# EAGLE design Power+LCD (EAGLE 7.5.0)
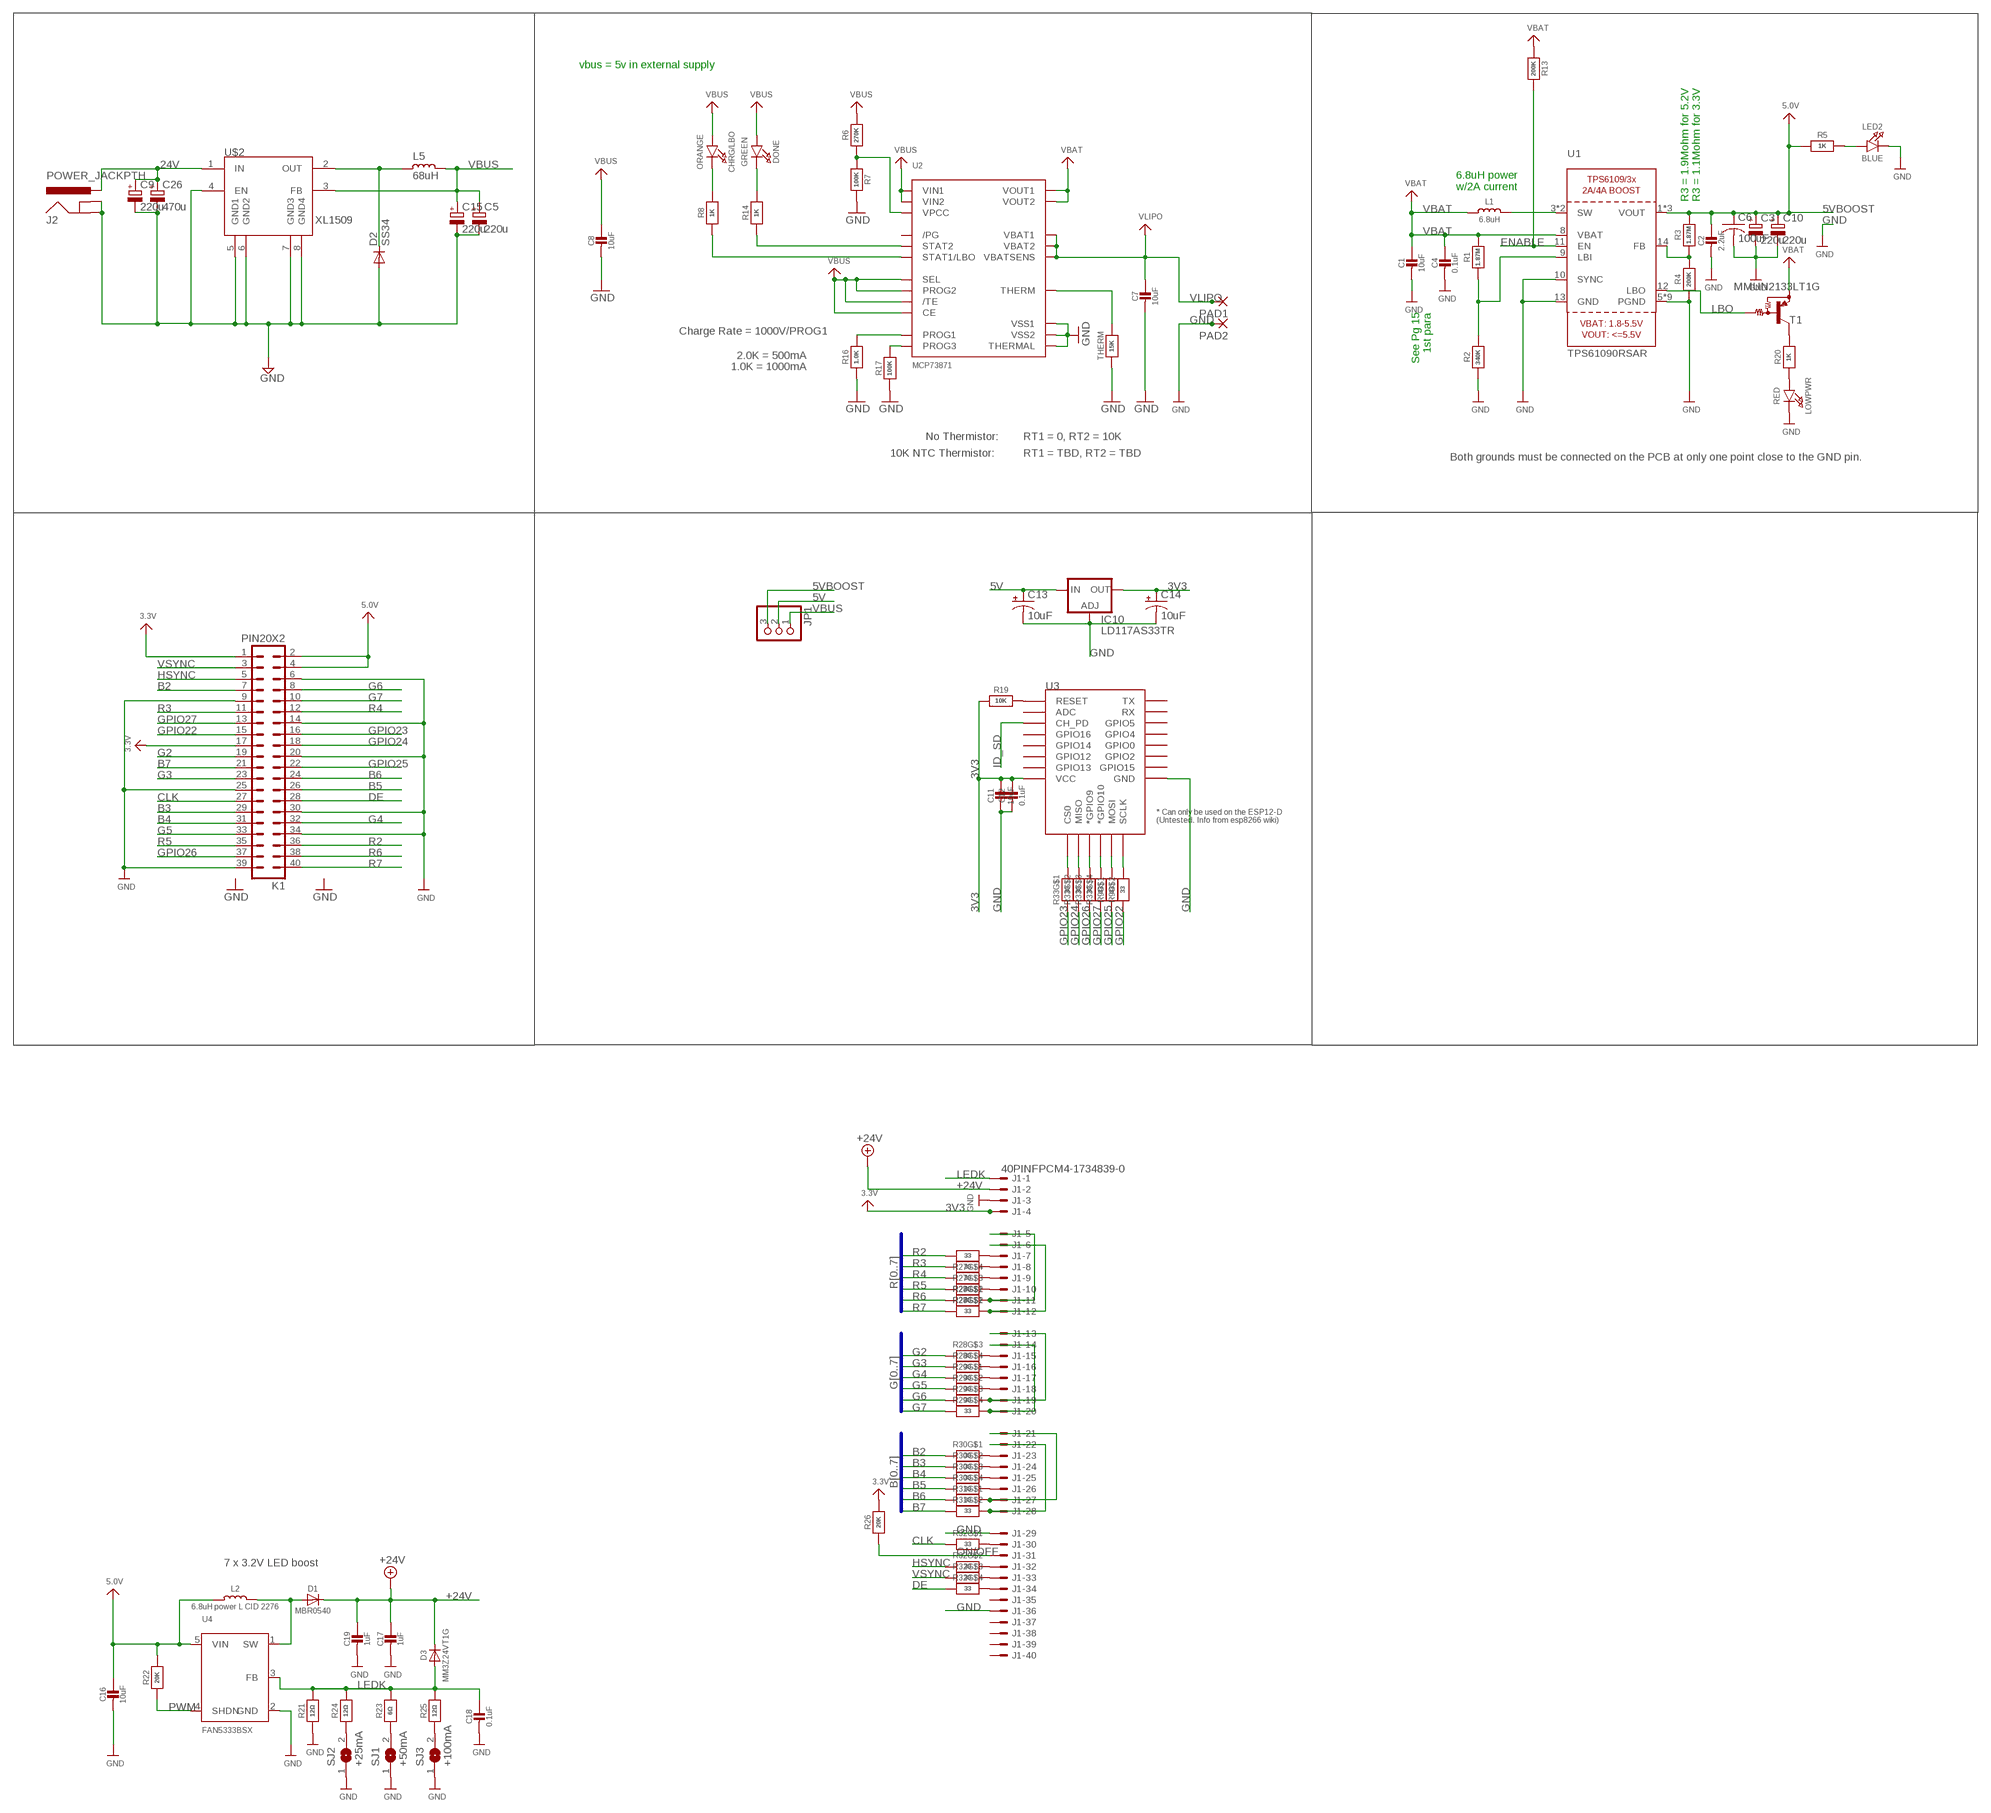
[diagram p0: schematic, sheet 1]

## Parts
C1  10uF  CAP_CERAMIC_1206MP  [_1206MP]
C2  2.2uF  CAP_CERAMIC0805-NOOUTLINE  [0805-NO]
C3  220u  CPOL-EUE2.5-7  [E2,5-7]
C4  0.1uF  CAP_CERAMIC0805_10MGAP  [0805_10MGAP]
C5  220u  CPOL-EUD  [PANASONIC_D]
C6  100uF  C-USC1210  [C1210]
C7  10uF  CAP_CERAMIC_1206MP  [_1206MP]
C8  10uF  CAP_CERAMIC_1206MP  [_1206MP]
C9  220u  CPOL-EUD  [PANASONIC_D]
C10  220u  CPOL-EUD  [PANASONIC_D]
C11  10uF  CAP_CERAMIC_1206MP  [_1206MP]
C12  0.1uF  CAP_CERAMIC0805_10MGAP  [0805_10MGAP]
C13  10uF  CAP_POL1206  [EIA3216]
C14  10uF  CAP_POL1206  [EIA3216]
C15  220u  CPOL-EUE2.5-7  [E2,5-7]
C16  10uF  CAP_CERAMIC_1206MP  [_1206MP]
C17  1uF  CAP_CERAMIC_0805MP  [_0805MP]
C18  0.1uF  CAP_CERAMIC0805-NOOUTLINE  [0805-NO]
C19  1uF  CAP_CERAMIC_0805MP  [_0805MP]
C26  470u  CPOL-EUE2.5-7  [E2,5-7]
CHRG/LBO  ORANGE  LED0805_NOOUTLINE  [CHIPLED_0805_NOOUTLINE]
D1  MBR0540  DIODESOD-123  [SOD-123]
D2  SS34  DIODE-DO-214AC  [DO-214AC]
D3  MM3Z24VT1G  DIODESMA  [SMADIODE]
DONE  GREEN  LED0805_NOOUTLINE  [CHIPLED_0805_NOOUTLINE]
IC10  LD117AS33TR  [SOT223]
J1  40PINFPCM4-1734839-0  [4-1734839-0]
J2  POWER_JACKPTH  [POWER_JACK_PTH]
JP1  PINHD-1X3  [1X03]
K1  PIN20X2  [PIN_20X2]
L1  6.8uH  INDUCTORTDK_VLC5045  [INDUCTOR_5X5MM_TDK_VLC5045]
L2  6.8uH power L CID 2276  INDUCTORNR5040  [INDUCTOR_5X5MM_NR5040_NOTHERMALS]
L5  68uH  L_CD75  [CD75]
LED2  BLUE  LED0805_NOOUTLINE  [CHIPLED_0805_NOOUTLINE]
LOWPWR  RED  LED0805_NOOUTLINE  [CHIPLED_0805_NOOUTLINE]
PAD1  3,81/1,4  [3,81/1,4]
PAD2  3,81/1,4  [3,81/1,4]
R1  1.87M  RESISTOR_0805MP  [_0805MP]
R2  340K  RESISTOR_0805MP  [_0805MP]
R3  1.87M  RESISTOR0805_NOOUTLINE  [0805-NO]
R4  200K  RESISTOR0805_NOOUTLINE  [0805-NO]
R5  1K  RESISTOR0805_NOOUTLINE  [0805-NO]
R6  270K  RESISTOR0805_NOOUTLINE  [0805-NO]
R7  100K  RESISTOR0805_NOOUTLINE  [0805-NO]
R8  1K  RESISTOR0805_NOOUTLINE  [0805-NO]
R9  33  RESISTOR_4PACK  [RESPACK_4X0603]
R13  200K  RESISTOR0805_NOOUTLINE  [0805-NO]
R14  1K  RESISTOR0805_NOOUTLINE  [0805-NO]
R16  1.0K  RESISTOR0805_NOOUTLINE  [0805-NO]
R17  100K  RESISTOR0805_NOOUTLINE  [0805-NO]
R19  10K  RESISTOR0805_NOOUTLINE  [0805-NO]
R20  1K  RESISTOR0805_NOOUTLINE  [0805-NO]
R21  12Ω  RESISTOR0805_NOOUTLINE  [0805-NO]
R22  20K  RESISTOR0805_NOOUTLINE  [0805-NO]
R23  6Ω  RESISTOR0805_NOOUTLINE  [0805-NO]
R24  12Ω  RESISTOR0805_NOOUTLINE  [0805-NO]
R25  12Ω  RESISTOR0805_NOOUTLINE  [0805-NO]
R26  20K  RESISTOR_0805MP  [_0805MP]
R27  33  RESISTOR_4PACK  [RESPACK_4X0603]
R28  33  RESISTOR_4PACK  [RESPACK_4X0603]
R29  33  RESISTOR_4PACK  [RESPACK_4X0603]
R30  33  RESISTOR_4PACK  [RESPACK_4X0603]
R31  33  RESISTOR_4PACK  [RESPACK_4X0603]
R32  33  RESISTOR_4PACK  [RESPACK_4X0603]
R33  33  RESISTOR_4PACK  [RESPACK_4X0603]
SJ1  +50mA  SOLDERJUMPER  [SOLDERJUMPER_ARROW_NOPASTE]
SJ2  +25mA  SOLDERJUMPER  [SOLDERJUMPER_ARROW_NOPASTE]
SJ3  +100mA  SOLDERJUMPER  [SOLDERJUMPER_ARROW_NOPASTE]
T1  MMUN2133LT1G  MUN2114T1-PNP_DRIVER-SC59-BEC  [SC59-BEC]
THERM  15K  RESISTOR0805_NOOUTLINE  [0805-NO]
U1  TPS61090RSAR  VREG_TPS6103X  [PVQFN-16]
U2  MCP73871  [QFN20_4MM]
U3  ESP12ESMD  [ESP12E-SMD]
U4  FAN5333BSX  FAN5331  [SOT23-5@1]
U$2  XL1509  [SO08]

## Nets
3V3: C11.1 C12.1 C14.A(+) IC10.4(OUT) J1.4 K1.1 K1.17 R19.1 R26.2 U3.VCC ; supply symbol labelled 3.3V
5V: C13.A(+) C16.1 IC10.3(IN) JP1.2 K1.2 K1.4 L2.P$1 R22.2 U4.5(VIN) ; supply symbol labelled 5.0V
5VBOOST: C2.1 C3.+ C6.1 C10.+ JP1.3 R3.2 R5.1 U1.1(VOUT) U1.15(VOUT) U1.16(VOUT) ; supply symbol labelled 5.0V
24V: C9.+ C26.+ J2.PWR U$2.1(IN)
+24V: C17.1 C19.1 D1.C D3.C J1.2
B2: K1.7 R30.1
B3: K1.29 R30.2
B4: K1.31 R30.3
B5: K1.26 R30.4
B6: K1.24 R31.1
B7: K1.21 R31.2
CLK: K1.27 R32.1
DE: K1.28 R32.4
ENABLE: R13.2 U1.11(EN)
G2: K1.19 R28.3
G3: K1.23 R28.4
G4: K1.32 R29.1
G5: K1.33 R29.2
G6: K1.8 R29.3
G7: K1.10 R29.4
GND: C1.2 C2.2 C3.- C4.2 C5.- C6.2 C7.2 C8.2 C9.- C10.- C11.2 C12.2 C13.C(-) C14.C(-) C15.- C16.2 C17.2 C18.2 C19.2 C26.- D2.2(A) IC10.1(ADJ) J1.3 J1.29 J1.36 J2.GND J2.GNDBREAK K1.6 K1.9 K1.14 K1.20 K1.25 K1.30 K1.34 K1.39 LED2.C LOWPWR.C PAD2.1(P) R2.1 R4.1 R7.2 R16.1 R17.1 R21.1 SJ1.1 SJ2.1 SJ3.1 THERM.1 U1.5(PGND) U1.6(PGND) U1.7(PGND) U1.10(SYNC) U1.13(GND) U1.P$18(PGND) U1.P$19(PGND) U1.P$20(PGND) U1.P$21(PGND) U1.P$22(PGND) U1.THERMAL(PGND) U2.P$10(VSS1) U2.P$11(VSS2) U2.P$21(THERMAL) U3.GND U4.2(GND) U$2.4(EN) U$2.5(GND1) U$2.6(GND2) U$2.7(GND3) U$2.8(GND4)
GPIO22: K1.15 R9.2
GPIO23: K1.16 R33.1
GPIO24: K1.18 R33.2
GPIO25: K1.22 R9.1
GPIO26: K1.37 R33.3
GPIO27: K1.13 R33.4
HSYNC: K1.5 R32.2
ID_SD: U3.CH_PD
LBO: T1.B U1.12(LBO)
LEDK: C18.1 D3.A J1.1 R21.2 R23.2 R24.2 R25.2 U4.3(FB)
N$1: L1.P$2 U1.3(SW) U1.4(SW)
N$2: LOWPWR.A R20.1
N$3: R1.1 R2.2 U1.9(LBI)
N$4: D2.1(C) L5.2 U$2.2(OUT)
N$5: R3.1 R4.2 U1.14(FB)
N$6: R20.2 T1.C
N$7: LED2.A R5.2
N$8: R6.1 R7.1 U2.P$2(VPCC)
N$9: R14.1 U2.P$7(STAT2)
N$10: R16.2 U2.P$13(PROG1)
N$11: R8.1 U2.P$8(STAT1/LBO)
N$12: R9.7 U3.SCLK
N$13: R9.8 U3.MOSI
N$14: R33.5 U3.GPIO10(*GPIO10)
N$15: R33.6 U3.GPIO9(*GPIO9)
N$16: R33.7 U3.MISO
N$17: R33.8 U3.CS0
N$18: D1.A L2.P$2 U4.1(SW)
N$19: THERM.2 U2.P$5(THERM)
N$20: DONE.C R14.2
N$21: CHRG/LBO.C R8.2
N$22: R17.2 U2.P$12(PROG3)
N$23: R23.1 SJ1.2
N$24: R24.1 SJ2.2
N$25: R19.2 U3.RESET
N$26: R25.1 SJ3.2
N$27: J1.6 J1.12 R28.7
N$28: J1.5 J1.11 R28.8
N$29: J1.10 R27.1
N$30: J1.9 R27.2
N$31: J1.8 R27.3
N$32: J1.7 R27.4
N$33: J1.15 R28.6
N$34: J1.16 R28.5
N$35: J1.17 R29.8
N$36: J1.18 R29.7
N$37: J1.13 J1.19 R29.6
N$38: J1.14 J1.20 R29.5
N$39: J1.23 R30.8
N$40: J1.24 R30.7
N$41: J1.25 R30.6
N$42: J1.26 R30.5
N$43: J1.21 J1.27 R31.8
N$44: J1.22 J1.28 R31.7
N$45: J1.30 R32.8
N$46: J1.32 R32.7
N$47: J1.33 R32.6
N$48: J1.34 R32.5
ON/OFF: J1.31 R26.1
PWM: R22.1 U4.4(SHDN)
R2: K1.36 R27.5
R3: K1.11 R27.6
R4: K1.12 R27.7
R5: K1.35 R27.8
R6: K1.38 R28.1
R7: K1.40 R28.2
VBAT: C1.1 C4.1 L1.P$1 R1.2 R13.1 T1.E U1.8(VBAT) U2.P$1(VOUT1) U2.P$20(VOUT2)
VBUS: C5.+ C8.1 C15.+ CHRG/LBO.A DONE.A JP1.1 L5.1 R6.2 U2.P$3(SEL) U2.P$4(PROG2) U2.P$9(/TE) U2.P$17(CE) U2.P$18(VIN1) U2.P$19(VIN2) U$2.3(FB)
VLIPO: C7.1 PAD1.1(P) U2.P$14(VBAT1) U2.P$15(VBAT2) U2.P$16(VBATSENS)
VSYNC: K1.3 R32.3
Unconnected: J1.35 J1.37 J1.38 J1.39 J1.40 R9.3 R9.4 R9.5 R9.6 R31.3 R31.4 R31.5 R31.6 U2.P$6(/PG) U3.ADC U3.GPIO0 U3.GPIO2 U3.GPIO4 U3.GPIO5 U3.GPIO12 U3.GPIO13 U3.GPIO14 U3.GPIO15 U3.GPIO16 U3.RXD0(RX) U3.TXD0(TX)

## Buses
R[0..7]
G[0..7]
B[0..7]

## Notes on the sheet
- vbus = 5v in external supply
- 6.8uH power
  w/2A current
- R3 = 1.9Mohm for 5.2V
  R3 = 1.1Mohm for 3.3V
- See Pg 15
  1st para
- Charge Rate = 1000V/PROG1
- 2.0K = 500mA
- 1.0K = 1000mA
- No Thermistor: | RT1 = 0, RT2 = 10K
- 10K NTC Thermistor: | RT1 = TBD, RT2 = TBD | Both grounds must be connected on the PCB at only one point close to the GND pin.
- 7 x 3.2V LED boost

## Library data of the parts
C1 C2 C4 C7 C8 C11 C12 C16-C19 = microbuilder:CAP_CERAMIC: Ceramic Capacitors For new designs, use the packages preceded by an '_' character since they are more reliable: The following footprints should be used on most boards: _0402 - Standard footprint for regular board layouts _0603 - Standard footprint for regular board layouts _0805 - Standard footprint for regular board layouts _1206 - Standard footprint for regular board layouts For extremely tight-pitch boards where space is at a premium, the following 'micro-pitch' footprints can be used (smaller pads, no silkscreen outline, etc.): _0402MP - Micro-pitch footprint for very dense/compact boards _0603MP - Micro-pitch footprint for very dense/compact boards _0805MP - Micro-pitch footprint for very dense/compact boards _1206MP - Micro-pitch footprint for very dense/compact boards
C3 C5 C9 C10 C15 C26 = rcl:CPOL-EU: POLARIZED CAPACITOR, European symbol
C6 = rcl:C-US: CAPACITOR, American symbol
C13 C14 = SparkFun:CAP_POL: Capacitor Polarized These are standard SMD and PTH capacitors. Normally 10uF, 47uF, and 100uF in electrolytic and tantalum varieties. Always verify the external diameter of the through hole cap, it varies with capacity, voltage, and manufacturer. The EIA devices should be standard.
CHRG/LBO DONE LED2 LOWPWR = microbuilder:LED: LED 0603 - 0603 Surface Mount Package 2mA: Green LED - Low Power (3.9mcd, 2ma, 1.7Vf) - Digikey: 475-2709-2-ND Orange LED - Low Power (9.8mcd, 2ma, 1.8Vf) - Digikey: 475-1194-2-ND Red LED - Low Power (5mcd, 2ma, 1.8Vf) - Digikey: 475-1195-2-ND Yellow LED - Low Power (7mcd, 2ma, 1.8Vf) - Digikey: 475-1196-2-ND 5mA: Blue LED - Low Power (17mcd, 5ma, 2.9Vf) - Digikey: LNJ937W8CRACT-ND 0805 - 0805 Surface Mount Package 2mA: Red LED (8.8mcd, 2mA, 1.8Vf, Clear) - Low Power [Digikey: 475-2510-1-ND] Green LED (5mcd, 2mA, 1.8Vf, Clear) - Low Power [Digikey: 475-2730-1-ND] Yellow LED (11.3mcd, 2mA, 1.8Vf, Clear) - Low Power [Digikey: 475-2555-1-ND] 20mA: Red LED (104mcd, 20mA, Diffused) - LS R976 [Digikey: 475-1278-6-ND] Red LED (12mcd, 20mA, 2.0Vf, Clear) - APT2012EC [Digikey: 754-1128-1-ND] Green LED (15mcd, 20mA, 2.2Vf, Clear) - APT2012GC [Digikey: 754-1131-1-ND] Orange LED (160mcd, 20mA, 2.1Vf, Clear) - APT2012SECK [Digikey: 754-1130-1-ND] 1206 - 1206 Surface Mount Package Green LED (26mcd, 20mA, Diffused) - LG N971 [Digikey: 475-1407-6-ND] Red LED (15mcd, 20mA, Diffused) - LH N974 [Digikey: 475-1416-6-ND] Cree - Cree High-Power Surface Mount LEDs XPEBWT-L1-0000-00D50 - White 111lm 350mA 2.9Vf 6200K 110° XTEAWT-00-0000-00000LEE3 - White 114lm 350mA 2.85Vf 5000K 115° Everlight - Everlight 45-21 Series Surface Mount LEDs 45-21/QK2C-B2832AC2CB2/2T - Warm White 2000mcd 20mA 3.25Vf 3050K 120° 45-21/LK2C-B38452C4CB2/2T - Nuetral White 2000mcd 20mA 3.25Vf 4150K 120° 45-21/LK2C-B50634C6CB2/2T - Cold White 2200mcd 20mA 3.25Vf 5650K 120° PLCC2 Reverse Mount LS T77K-J1L2-1-0-2-R18-Z - Red 11.25mcd 2mA 1.8Vf 630nm 120° LO T77K-L1M2-24-Z - Orange 19.6mcd 2mA 1.8Vf 606nm 120° LY T77K-K2M1-26-Z - Yellow 15.7mcd 2mA 1.8Vf 587nm 120°
D1 D3 = microbuilder:DIODE: Diode SMA Model Volts Amps Type Vf Ir Digikey # Notes SSA34-E3 40V 3A Schottky 480mV @ 3A 200uA @ 40V SSA34-E3/61TGITR-ND CDBA120-G 20V 1A Schottky 500mV @ 1A 500uA @ 20V 641-1014-6-ND REEL MBRA210 10V 2A Schottky 350mV @ 2A 700uA @ 10V MBRA210LT3 SOD-123 Model Volts Amps Type Vf Ir Order # Notes BAT54T1G 30V 200mA Schottky 800mV @ 200mA 2uA @ 25V BAT54T1GOSTR-ND B0530W 30V 500mA Schottky 430mV @ 500mA 130uA @ 30V B0530W-FDICT-ND REEL MBR120 20V 1A Schottky 340mV @ 1A MBR120VLSFT1GOSCT-ND SOD-323 Model Volts Amps Type Vf Ir Order # Notes PMEG2005EJ 20V 500mA Schottky 355mV @ 500mA 568-4110-1-ND ZLLS410 10V 570mA Schottky 380mV @ 570mA ZLLS410CT-ND 1N4148WS 75V 150mA Silicon/Simple 1V 1N4148WSFSCT-ND REEL SOD-523 Model Volts Amps Type Vf Ir Order # Notes BAT54XV2 30V 200mA Schottky 0.8V @ 100mA BAT54XV2CT-ND TB751S 30V 30mA Schottky RB751S-40TE61CT-ND SOT23-R/W (R = Solder Paste/Reflow Ovens, W = Hand-Soldering) Model Volts Amps Type Vf Ir Order # Notes BAT54FILM 40V 300mA Schottky 497-7162-1-ND POWERDI-5 Model Volts Amps Type Vf Ir Order # Notes PDS560 60V 5A Schottky 670mV @ 5A 150uA @ 60V PDS560DICT-ND
D2 = dp_devices:DIODE: Various Diode Packages
IC10 = v-reg:LD117A?*: Low drop fixed and adjustable positive voltage regulators 1 A Source: http://www.st.com/stonline/products/literature/ds/7194/ld1117axx.pdf
J1 = adafruit:40PINFPC: OMRON FPC Connector Source : http://www.omron.com/ecb/products/pdf/fpc.pdf XF2M-4015-rev is good for connecting up 'PSP' SHARP LQ043 LCDs
J2 = SparkFun-Connectors:POWER_JACK: Power Jack This is the standard 5.5mm barrel jack for power. The PTH is the most common, proven, reliable, footprint. The Slot footprint only works if the mill layer is transmitted to the PCB fab house so be warned. Mating wall wart : TOL-00298 (and others); PROD_ID: CONN-08197
JP1 = pinhead:PINHD-1X3: PIN HEADER
K1 = FLYFISH:PIN20X2
L1 L2 = microbuilder:INDUCTOR: Inductors 0603: 10nH Ceramic Inductor - microwire antenna/RF (Digikey: 712-1434-2-ND) 0805: 560nH Ceramic Inductor - RF (Digikey: 553-1047-1-ND) 270nH Ceramic Inductor - Q = 40@250MHz, +-5%, 1 Ohm DC Resistance (Digikey: 535-10506-2-ND) 1007 (2518 Metric) SMT: 10µH 10% 250mOhm 820mA 1007 Inductor (Digikey: 587-2189-1-ND) 22µH 10% 500mOhm 580mA 1007 Inductor (Digikey: 587-2190-1-ND) 47µH 10% 950mOhm 420mA 1007 Inductor (Digikey: 587-2191-1-ND) 47µH 5% 100mOhm 1A 1008 Inductor (Digikey: 732-1816-1-ND) 5.0x5.0mm (Taiyo Yuden NR5040 Series) 6.8µH 20% 2.3A 64mOhm Inductor (Digikey: 587-2374-2-ND) 5.0x5.0mm (TDK VLC5045 Series) 4.7µH 20% 3.3A 34mOhm Inductor (Digikey: 445-6526-1-ND) 6.8µH 20% 2.7A 46mOhm Inductor (Digikey: 445-6527-1-ND) 6.0x6.0mm (TDK VLC6045 Series) 4.7µH 20% 3.8A 27mOhm Inductor (Digikey: 445-6538-2-ND) 6.8µH 20% 3A 41mOhm Inductor (Digikey: 445-6540-1-ND) 6.2µH 30% 2.2A 45mOhm Inductor (Digikey: SRR5028-6R2YCT-ND) - Not TDK VLC6045 but footprint should match 6.0x6.0mm (TDK SLF6045 Series) 6.8uH 30% 2A 33mOhm Inductor (Digikey: 445-4572-1-ND, Mouser: 810-SLF645T6R8N2R0PF) 6.0x6.0mm (Sumida CDRH5D28 Series) 6.2uH 30% 1.8A 45mOhm Inductor (Digikey: 308-1542-1-ND) Taiyo Yuden NR3015T2R2M - 2.2uH 20% 1.5A (Digikey: 587-1648-2-ND, Mouser: 963-NR3015T2R2M) - Used with TI TPS62172 CoilCraft RFID Transponder Coil - MA5532-AE (For use with AS3935 Lightning Sensor) Vishay IHLP 1.0uH Molded Inductor - 24mOhm DCR, 5A, +/-20%, -55°C-125°C (Digikey: 541-1319-1-ND)
L5 = rc-master-smd:L_: INDUCTOR
PAD1 PAD2 = wirepad:3,81/1,4: THROUGH-HOLE PAD
R1-R8 R13 R14 R16 R17 R19-R26 THERM = microbuilder:RESISTOR: Resistors For new designs, use the packages preceded by an '_' character since they are more reliable: The following footprints should be used on most boards: _0402 - Standard footprint for regular board layouts _0603 - Standard footprint for regular board layouts _0805 - Standard footprint for regular board layouts _1206 - Standard footprint for regular board layouts For extremely tight-pitch boards where space is at a premium, the following 'micro-pitch' footprints can be used (smaller pads, no silkscreen outline, etc.): _0402MP - Micro-pitch footprint for very dense/compact boards _0603MP - Micro-pitch footprint for very dense/compact boards _0805MP - Micro-pitch footprint for very dense/compact boards _1206MP - Micro-pitch footprint for very dense/compact boards
R9 R27-R33 = microbuilder:RESISTOR_4PACK: Resistor Packs (4 resistors) 4 x 0603 10K 1/16W - Digikey: YC164J-10KCT-ND
SJ1-SJ3 = microbuilder:SOLDERJUMPER: SMD Solder JUMPER Solder the two pads together to create a connection, or remove the solder to break it. REFLOW - Use this footprint for solder paste and reflow ovens. WAVE - Use this footprint for hand-soldering (larger pads). CLOSED - Has a trace between the two pads to ensure it is closed by default. The trace needs to be cut to disable the jumper, and can be closed again by creating a solder bridge between the two pads.; BOM: EXCLUDE
T1 = transistor:*-PNP_DRIVER-: PNP Bias Resistor Transistor
U1 = microbuilder:VREG_TPS6103X: TPS6103x 4A Boost - 1.8-5.5V Input, Adjustable Output to 5.5V
U2 = microbuilder:MCP73871: MCP73871 Lithium Polymer Battery Charger Digikey: MCP73871-2CCI/ML-ND
U3 = esp8266modules:ESP12E: ESP12E Module
U4 = microbuilder:FAN5331: FAN5331 - LED/OLED 20V Boost Converter Digikey: FAN5331SXCT-ND
U$2 = Cohesion_parts:XL1509

## Board
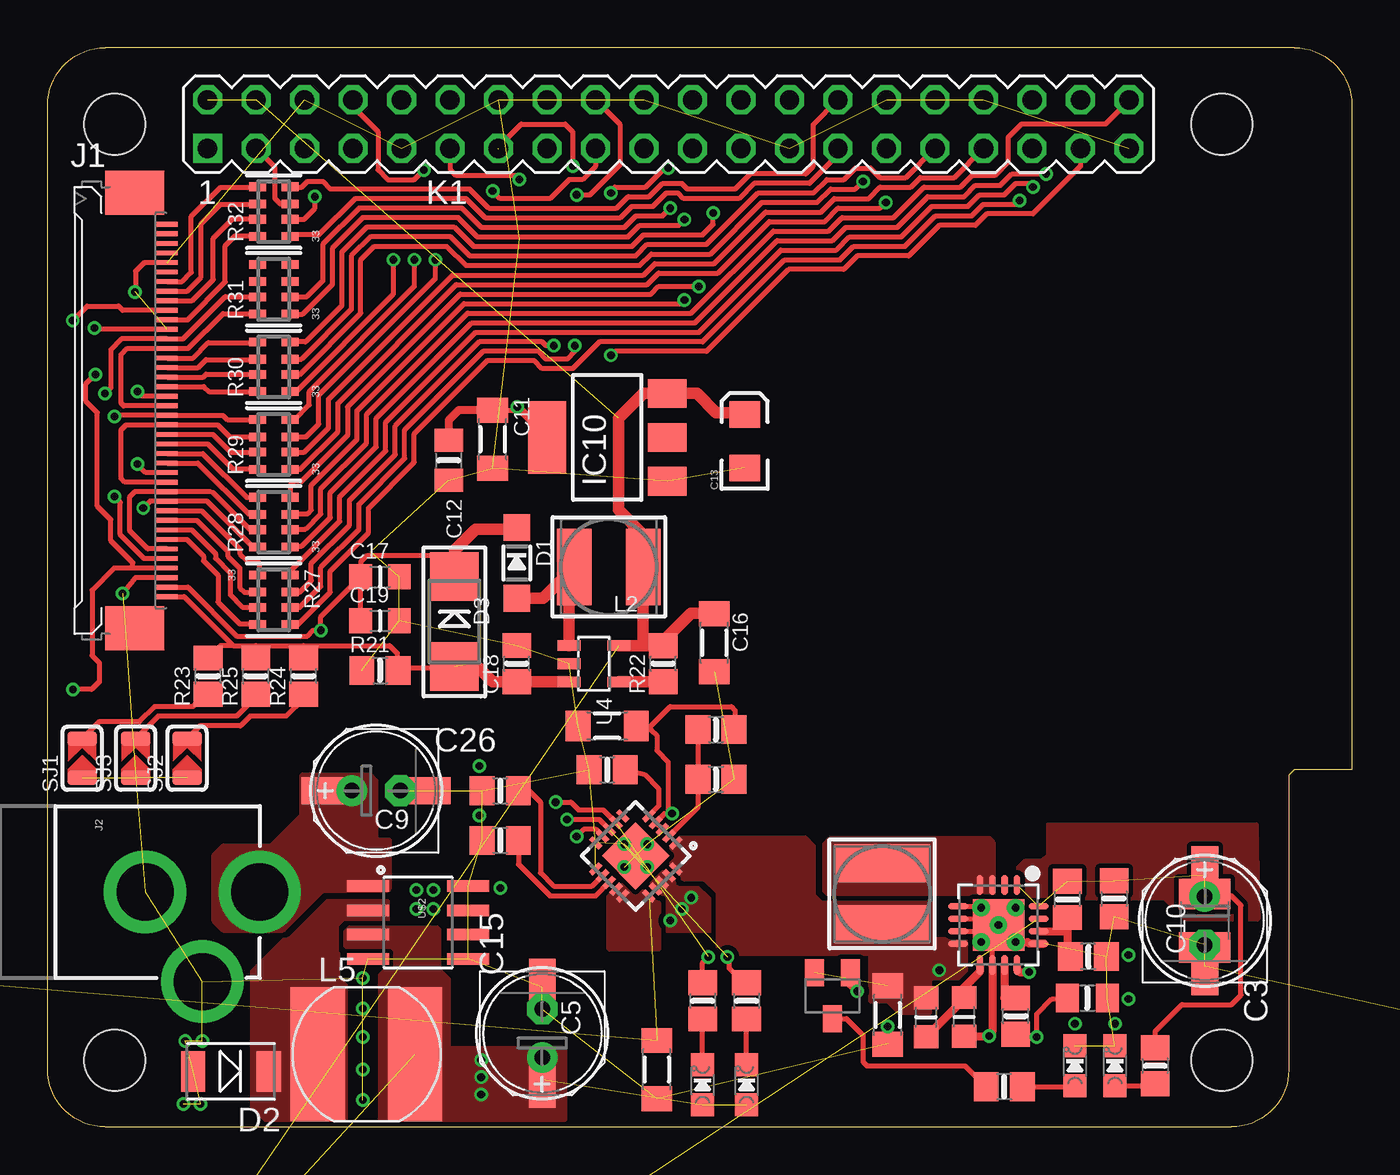
[diagram p1: board, top side]
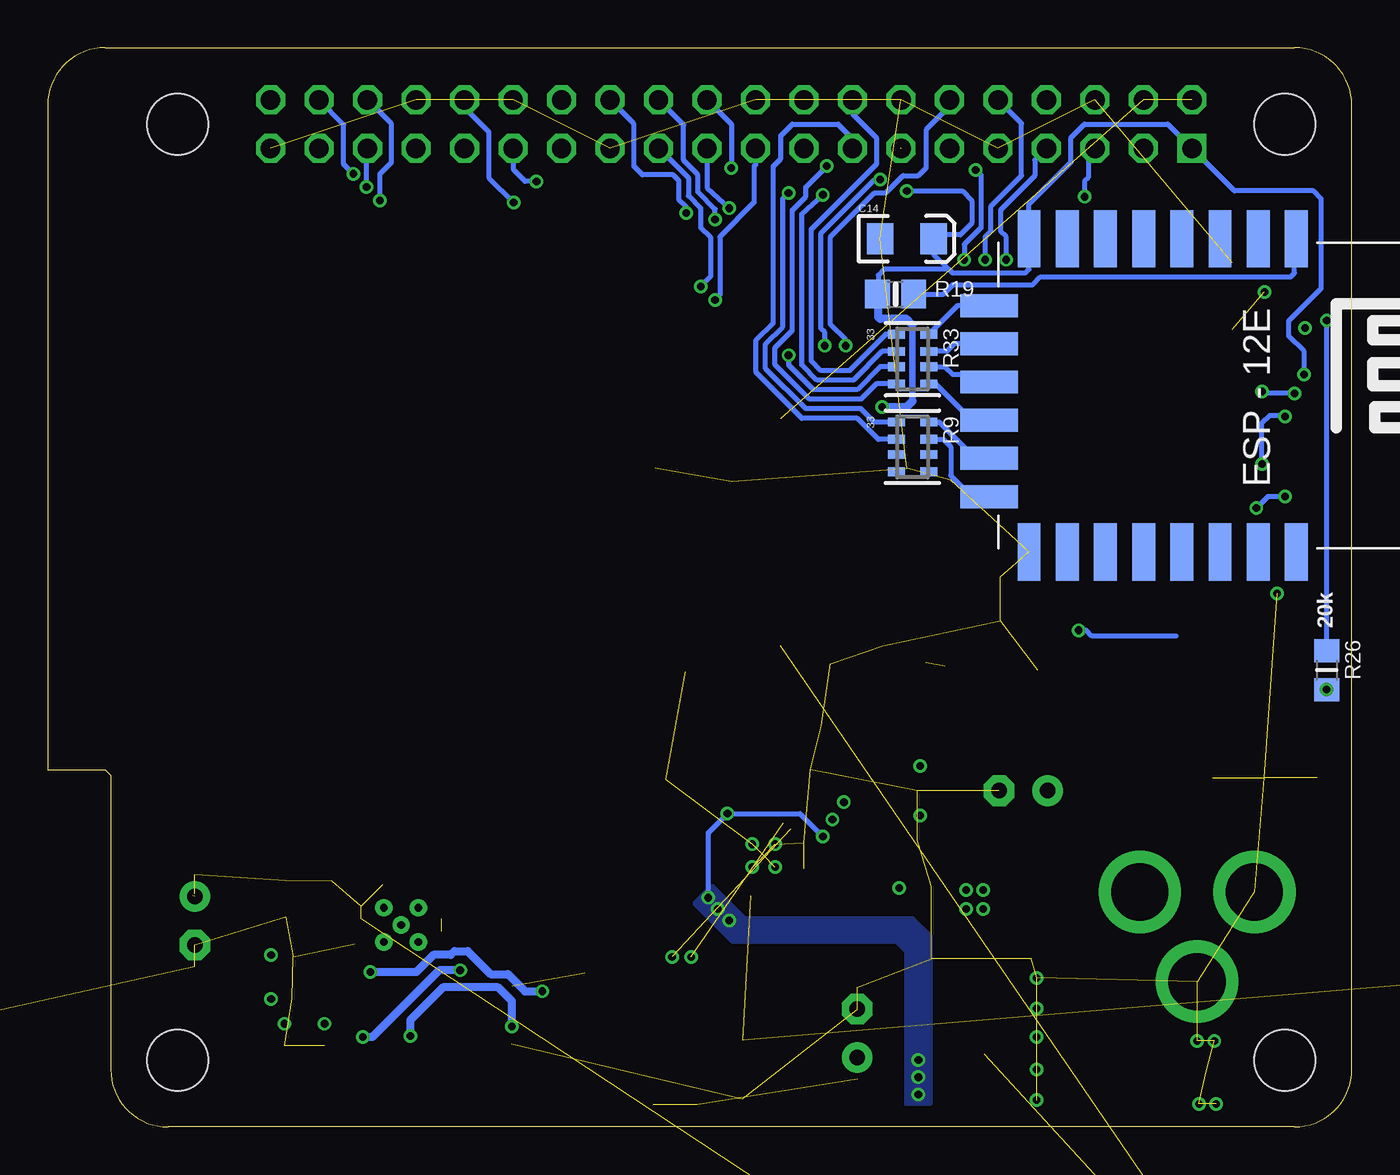
[diagram p2: board, bottom side, seen from below]

Size 68.3 x 56.5 mm. Coordinates in mm from the lower left corner, seen from the top.
Outline: 0,53.5 arc-90 3,56.5 65.3,56.5 arc-90 68.3,53.5 68.3,18.7 65.3,18.7 65,18.4 65,3 arc-90 62,0 3,0 arc-90 0,3 0,53.5
Copper layers (1*16): Top 0.035mm / dielectric 1.5mm / Bottom 0.035mm
Design rules "ITEADstudio_DRC *": minimum track width 6mil, minimum drill 12mil, track to track 8mil, track to pad 8mil, pad to pad 8mil, via to via 8mil, smd to smd 0mil, copper to edge 10mil, drill to drill 10mil, minimum pad ring 10mil, minimum via ring 6mil, stop-mask expansion 2mil, vias tented up to drill 100mil, thermal gap 10mil
Holes 3.2 mm at 3.5,3.5 61.5,3.5 61.5,52.5 3.5,52.5
tRestrict: area 1.5,50.5 to 5.5,54.5; area 59.5,50.5 to 63.5,54.5; area 59.5,1.5 to 63.5,5.5; area 1.5,1.5 to 5.5,5.5
bRestrict: area 1.5,1.5 to 5.5,5.5; area 59.5,1.5 to 63.5,5.5; area 59.5,50.5 to 63.5,54.5; area 1.5,50.5 to 5.5,54.5; 20 lines

### Footprints (pad centres in the part's own frame; a part is rotated, then mirrored left to right if it is on the bottom)
_1206MP = smd 1.3 x 1.6: 1 -1.524,0; 2 1.524,0
0805-NO = smd 1.3 x 1.5: 1 -0.95,0; 2 0.95,0
E2,5-7 = drill 0.813 pad 1.6: + -1.27,0 | drill 0.813 pad 1.6 octagon: - 1.27,0
0805_10MGAP = smd 1.2 x 1.5: 1 -1.05,0; 2 1.05,0
PANASONIC_D = smd 3 x 1.4: + 2.4,0; - -2.4,0
C1210 = smd 1.6 x 2.7: 1 -1.4,0; 2 1.4,0
EIA3216 = smd 1.4 x 1.6: A 1.4,0; C -1.4,0
_0805MP = smd 1.2 x 1.3: 1 -1.016,0; 2 1.016,0
CHIPLED_0805_NOOUTLINE = smd 1.2 x 1.2: A 0,-1.05; C 0,1.05
SOD-123 = smd 1.4 x 1.4: A 1.85,0; C -1.85,0
DO-214AC = smd 1.27 x 2.1: 1 -1.98,0; 2 1.98,0
SMADIODE = smd 2.54 x 2.54: A 2.349,0; C -2.349,0
SOT223 = smd 1.5 x 2: 1 -2.3,-3.15; 2 0,-3.15; 3 2.3,-3.15 | smd 3.8 x 2: 4 0,3.15
4-1734839-0 = smd 0.25 x 1.1: 1 -9.75,-2.54; 2 -9.25,-2.54; 3 -8.75,-2.54; 4 -8.25,-2.54; 5 -7.75,-2.54; 6 -7.25,-2.54; 7 -6.75,-2.54; 8 -6.25,-2.54; 9 -5.75,-2.54; 10 -5.25,-2.54; 11 -4.75,-2.54; 12 -4.25,-2.54; 13 -3.75,-2.54; 14 -3.25,-2.54; 15 -2.75,-2.54; 16 -2.25,-2.54; 17 -1.75,-2.54; 18 -1.25,-2.54; 19 -0.75,-2.54; 20 -0.25,-2.54; 21 0.25,-2.54; 22 0.75,-2.54; 23 1.25,-2.54; 24 1.75,-2.54; 25 2.25,-2.54; 26 2.75,-2.54; 27 3.25,-2.54; 28 3.75,-2.54; 29 4.25,-2.54; 30 4.75,-2.54; 31 5.25,-2.54; 32 5.75,-2.54; 33 6.25,-2.54; 34 6.75,-2.54; 35 7.25,-2.54; 36 7.75,-2.54; 37 8.25,-2.54; 38 8.75,-2.54; 39 9.25,-2.54; 40 9.75,-2.54 | smd 2.3 x 3.1: M1 11.4,-0.84; M2 -11.4,-0.84
POWER_JACK_PTH = drill 2.997 pad 4.318: GND 0,7.7; GNDBREAK 4.7,10.7; PWR 0,13.7
1X03 = drill 1.016 long: 1 -2.54,0; 2 0,0; 3 2.54,0
PIN_20X2 = drill 1.016 square: 1 -24.13,-1.27 | drill 1.016 octagon: 2 -24.13,1.27; 3 -21.59,-1.27; 4 -21.59,1.27; 5 -19.05,-1.27; 6 -19.05,1.27; 7 -16.51,-1.27; 8 -16.51,1.27; 9 -13.97,-1.27; 10 -13.97,1.27; 11 -11.43,-1.27; 12 -11.43,1.27; 13 -8.89,-1.27; 14 -8.89,1.27; 15 -6.35,-1.27; 16 -6.35,1.27; 17 -3.81,-1.27; 18 -3.81,1.27; 19 -1.27,-1.27; 20 -1.27,1.27; 21 1.27,-1.27; 22 1.27,1.27; 23 3.81,-1.27; 24 3.81,1.27; 25 6.35,-1.27; 26 6.35,1.27; 27 8.89,-1.27; 28 8.89,1.27; 29 11.43,-1.27; 30 11.43,1.27; 31 13.97,-1.27; 32 13.97,1.27; 33 16.51,-1.27; 34 16.51,1.27; 35 19.05,-1.27; 36 19.05,1.27; 37 21.59,-1.27; 38 21.59,1.27; 39 24.13,-1.27; 40 24.13,1.27
INDUCTOR_5X5MM_TDK_VLC5045 = smd 2 x 5: P$1 -1.6,0; P$2 1.6,0
INDUCTOR_5X5MM_NR5040_NOTHERMALS = smd 1.8 x 4: P$1 -1.8,0; P$2 1.8,0
CD75 = smd 7 x 2.85: 1 0,2.54; 2 0,-2.54
3,81/1,4 = drill 1.397 pad 3.81 octagon: 1 0,0
RESPACK_4X0603 = smd 0.45 x 0.9: 1 -1.3,-0.85; 2 -0.4,-0.85; 3 0.4,-0.85; 4 1.3,-0.85; 5 1.3,0.85; 6 0.4,0.85; 7 -0.4,0.85; 8 -1.3,0.85
SOLDERJUMPER_ARROW_NOPASTE = smd 0.762 x 1.524: 1 -1.016,0; 2 1.016,0
SC59-BEC = smd 1 x 1.4: B -0.95,-1.2; C 0,1.2; E 0.95,-1.2
PVQFN-16 = smd 1.05 x 0.35: 1 -2.1,0.975; 2 -2.1,0.325; 3 -2.1,-0.325; 4 -2.1,-0.975; 9 2.1,-0.975; 10 2.1,-0.325; 11 2.1,0.325; 12 2.1,0.975 | smd 0.35 x 1.05: 5 -0.975,-2.1; 6 -0.325,-2.1; 7 0.325,-2.1; 8 0.975,-2.1; 13 0.975,2.1; 14 0.325,2.1; 15 -0.325,2.1; 16 -0.975,2.1 | drill 0.4: P$18 0,0; P$19 -0.9,0.9; P$20 0.9,0.9; P$21 0.9,-0.9; P$22 -0.9,-0.9 | smd 2.7 x 2.7: THERMAL 0,0
QFN20_4MM = smd 0.73 x 0.28: P$1 -1.965,1; P$2 -1.965,0.5; P$3 -1.965,0; P$4 -1.965,-0.5; P$5 -1.965,-1; P$11 1.965,-1; P$12 1.965,-0.5; P$13 1.965,0; P$14 1.965,0.5; P$15 1.965,1 | smd 0.28 x 0.73: P$6 -1,-1.965; P$7 -0.5,-1.965; P$8 0,-1.965; P$9 0.5,-1.965; P$10 1,-1.965; P$16 1,1.965; P$17 0.5,1.965; P$18 0,1.965; P$19 -0.5,1.965; P$20 -1,1.965 | smd 2.5 x 2.5: P$21 0,0
ESP12E-SMD = smd 3 x 1.2: ADC -8.3,3.8; CH_PD -8.3,1.8; GND 8.1,-8.2; GPIO0 8.1,-2.2; GPIO2 8.1,-4.2; GPIO4 8.1,-0.2; GPIO5 8.1,1.8; GPIO12 -8.3,-4.2; GPIO13 -8.3,-6.2; GPIO14 -8.3,-2.2; GPIO15 8.1,-6.2; GPIO16 -8.3,-0.2; RESET -8.3,5.8; RXD0 8.1,3.8; TXD0 8.1,5.8; VCC -8.3,-8.2 | smd 1.2 x 3: CS0 -4.8,-10.3; GPIO9 -0.8,-10.3; GPIO10 1.2,-10.3; MISO -2.8,-10.3; MOSI 3.2,-10.3; SCLK 5.2,-10.3
SOT23-5@1 = smd 0.55 x 1.2: 1 -0.95,-1.3; 2 0,-1.3; 3 0.95,-1.3; 4 0.95,1.3; 5 -0.95,1.3
SO08 = smd 0.61 x 2.21: 1 -1.905,-2.616; 2 -0.635,-2.616; 3 0.635,-2.616; 4 1.905,-2.616; 5 1.905,2.616; 6 0.635,2.616; 7 -0.635,2.616; 8 -1.905,2.616

### Placement (x,y rotation side)
C1  43.99,5.86 270 top
C2  55.85,11.95 270 top
C3  60.6,10.8 270 top
C4  54.45,6.75 0 top
C5  25.9,4.9 270 top
C6  60.6,10.8 270 top
C7  31.9,3 270 top
C8  29.3,21 180 top
C9  17.2,17.6 180 top
C10  60.6,10.8 90 top
C11  23.3,36 270 top
C12  21,34.9 270 top
C13  36.5,35.9 90 top
C14  23.3,46.5 0 bottom
C15  25.9,4.9 90 top
C16  34.91,25.35 270 top
C17  17.4,28.8 0 top
C18  24.56,24.25 90 top
C19  17.4,26.5 0 top
C26  17.2,17.6 0 top
CHRG/LBO  36.6,2.2 0 top
D1  24.56,29.53 270 top
D2  9.6,2.9 180 top
D3  21.3,26.46 270 top
DONE  34.3,2.2 0 top
IC10  29.3,36.1 90 top
J1  3.71,37.51 90 top
J2  -2.6,12.3 270 top
JP1  -3.9,-24.2 0 top  (outside the outline)
K1  32.5,52.5 0 top
L1  43.7,12.2 90 top
L2  29.39,29.32 180 top
L5  16.7,3.8 270 top
LED2  55.9,3.2 0 top
LOWPWR  53.8,3.2 0 top
PAD1  -6.1,7.7 180 top  (outside the outline)
PAD2  77.3,4.7 180 top  (outside the outline)
R1  46.01,5.74 90 top
R2  48,5.76 90 top
R3  53.41,11.91 90 top
R4  54.5,8.92 180 top
R5  58,3.2 270 top
R6  35,20.8 0 top
R7  35,18.2 0 top
R8  36.6,6.6 270 top
R9  23,35.6 270 bottom
R13  50.7,5.8 90 top
R14  34.3,6.6 270 top
R16  23.7,15 0 top
R17  23.7,17.6 0 top
R19  23.9,43.6 0 bottom
R20  50.1,2.1 180 top
R21  17.4,23.9 0 top
R22  32.23,24.25 90 top
R23  8.4,23.6 90 top
R24  13.4,23.6 90 top
R25  10.9,23.6 90 top
R26  1.31,23.91 270 bottom
R27  11.84,27.6 270 top
R28  11.84,31.66 90 top
R29  11.84,35.73 90 top
R30  11.84,39.79 90 top
R31  11.84,43.86 90 top
R32  11.84,47.92 90 top
R33  23,40.2 270 bottom
SJ1  1.8,19.3 90 top
SJ2  7.3,19.3 90 top
SJ3  4.6,19.3 90 top
T1  41.1,6.87 180 top
THERM  29.3,18.7 0 top
U1  49.79,10.57 270 top
U2  30.8,14.19 225 top
U3  8.7,38.2 270 bottom
U4  28.61,24.25 270 top
U$2  19.4,10.7 270 top

### Tracks (layer width: path | path; a pad name or v marks a point on that pad's centre or on a via)
3V3  (via drill 0.4)
  Top 0.254: J1.4 4.45,29.26 | 4.45,29.26 3.47,29.26 2.32,28.11 2.32,24.68 2.7,24.3 2.7,23.3 2.3,22.9 v1.32,22.9 | 4.45,29.26 4.45,29.55 3.3,30.7 3.3,31.8 2.6,32.5 2.6,37.4 2,38 2,38.9 v2.5,39.4 | K1.17 28.69,50.29 28,49.6 27.3,49.6 26.3,48.6 23.7,48.6 v23.3,49 | C11.1 24.42,37.52 v24.6,37.7
  Top 0.406: C11.1 21.52,37.52 21,37 C12.1 | IC10.4 26.15,36.15 v24.6,37.7
  Bottom 0.254: v1.32,22.9 R26.2 | v2.5,39.4 2.5,40.6 3.3,41.4 3.3,42.2 1.6,43.9 1.6,48.6 2,49 6.14,49 K1.1 9.64,52.5 14,52.5 14.7,51.8 14.7,50.5 16.9,48.3 U3.VCC 16.9,44.9 17.1,44.7 20.9,44.7 21.1,44.9 | v23.3,49 20.4,49 19.9,48.5 19.9,47.3 20.5,46.7 21.7,46.7 C14.A 21.9,45.7 21.1,44.9 | R19.1 24.85,43.85 | 21.1,44.9 24.5,44.9 24.8,44.6 24.8,43.65 R19.1 | 24.8,43.55 R19.1
  Bottom 0.35: 23,38 23,42
  Bottom 0.406: v24.6,37.7 23.3,37.7 23,38 | 23,42 23.3,42.3 24.7,42.3 24.8,42.4 24.8,43.55
5V  (3 unrouted)
  Top 0.61: U4.5 31.4,25.2 | 31.4,25.2 R22.2 32.23,25.43 33.7,26.9 34.8,26.9 C16.1 | 31.4,25.2 31.19,25.41 L2.P$1 31.19,31.01 29.9,32.3 29.9,37.1 31.2,38.4 IC10.3 34,38.4 35,37.4 36.4,37.4 C13.A
  pour Top (isolate 0.254, rank 2, no thermals): 50.7,12.2 51.3,12.2 51.3,10.8 52.4,10.8 52.4,12 58.5,12 59.6,10.9 63.4,10.9 63.3,15.8 52.4,15.8 52.4,14.2 52.1,13.9 51.2,13.9 50.7,13.4
5VBOOST  (8 unrouted)
  Top 0.254: R5.1 58,5 59.4,6.4 62,6.4 62.5,6.9 62.5,11.6 62,12.1 60.7,12.1 C6.1
  Top 0.305: 50.8,12.7 U1.1
24V
  pour Top (isolate 0.254, no thermals): 13.3,18.4 13.3,16.3 11.7,14.7 9.2,14.7 8.7,14.2 8.7,10.8 9.2,10.3 12.3,10.3 14.4,12.4 17.8,12.4 17.9,12.5 17.9,15 17.2,15 17.2,18.1 16.9,18.4
+24V  (via drill 0.4)
  Top 0.254: J1.2 7.34,28.26 9.9,25.7 13.6,25.7 13.9,26 v14.3,26 14.3,26.7 15.9,28.3 C17.1 | D1.C 24.52,31.38 | 21.39,28.2 D3.C 21.3,28.9 20.7,29.9 16.7,29.9 16.4,29.6 16.4,28.32 C17.1 | C19.1 C17.1
  Top 0.61: 24.6,31.34 D1.C 24.49,31.3 22.4,31.3 21.3,30.2 D3.C
  Bottom 0.254: 9.2,25.7 13.6,25.7 13.9,26 v14.3,26
B2  (via drill 0.4)
  Top 0.254: R30.1 12.7,38.5 13,38.5 18.1,43.6 v18.1,45.4
  Bottom 0.254: K1.7 16.6,50.62 16.6,49.8 18.4,48 18.4,46.9 18.1,46.6 v18.1,45.4
B3  (via drill 0.4)
  Top 0.254: v42.7,49.5 42.3,49.1 41,49.1 40.3,48.4 37.4,48.4 34.7,45.7 31.6,45.7 31,45.1 21.9,45.1 20.9,46.1 17.1,46.1 16.4,45.4 16.4,42.6 13.19,39.39 R30.2
  Bottom 0.254: v42.7,49.5 43.3,49.5 43.9,50.1 43.9,51.2 K1.29
B4
  Top 0.254: K1.31 44.94,49.7 43.6,49.7 43.1,50.2 42.3,50.2 41.7,49.6 40.8,49.6 40.1,48.9 37.2,48.9 34.5,46.2 31.4,46.2 30.8,45.6 22.1,45.6 21.1,46.6 16.9,46.6 15.9,45.6 15.9,42.8 13.29,40.19 R30.3
B5  (via drill 0.4)
  Top 0.254: v34.85,47.85 34.85,47.25 34.3,46.7 31.2,46.7 30.6,46.1 22.3,46.1 21.3,47.1 16.7,47.1 15.4,45.8 15.4,43 13.5,41.1 12.7,41.1 R30.4
  Bottom 0.254: K1.26 37.6,52.52 37.6,50.3 37.15,49.85 35.55,49.85 35.25,49.55 35.25,48.55 34.85,48.15 v34.85,47.85
B6  (via drill 0.4)
  Top 0.254: v33.35,47.5 33.05,47.2 31,47.2 30.4,46.6 22.5,46.6 21.5,47.6 16.5,47.6 14.9,46 14.9,44.1 13.36,42.56 R31.1
  Bottom 0.254: K1.24 35,52.46 35,50.6 34.25,49.85 34.25,48.95 33.35,48.05 v33.35,47.5
B7  (via drill 0.4)
  Top 0.254: v32.6,48.1 32.2,47.7 30.8,47.7 30.2,47.1 22.7,47.1 21.7,48.1 16.3,48.1 14.4,46.2 14.4,44.3 13.56,43.46 R31.2
  Bottom 0.254: K1.21 33.77,49.17 v32.6,48.1
CLK
  Top 0.254: K1.27 41.39,50.89 39.9,49.4 37,49.4 36.2,48.6 33.3,48.6 33,48.9 32.4,48.9 31.7,48.2 30.6,48.2 30,47.6 22.9,47.6 21.9,48.6 16.1,48.6 14.2,46.7 12.77,46.7 R32.1
DE
  Top 0.254: K1.28 40.1,52.48 40.1,50.3 39.7,49.9 36.8,49.9 36,49.1 33.5,49.1 33.2,49.4 32.2,49.4 31.5,48.7 30.4,48.7 29.8,48.1 23.1,48.1 22.1,49.1 14.8,49.1 14.4,49.5 13.6,49.5 13.3,49.2 12.81,49.2 R32.4
ENABLE
  Top 0.254: 50.1,8.45 U1.11
  Top 0.406: 50.1,8.45 50.1,6.75 R13.2
G2  (via drill 0.4)
  Top 0.254: R28.3 12.73,32.1 13.6,32.1 13.8,32.3 13.8,33.6 16.2,36 16.2,37.5 21.8,43.1 33.15,43.1 v33.35,43.3
  Bottom 0.254: K1.19 31.23,50.37 31.3,50.3 31.3,48.4 33.1,46.6 33.1,43.55 v33.35,43.3
G3  (via drill 0.4)
  Top 0.254: v34.1,44 32,44 31.6,43.6 21.6,43.6 15.7,37.7 15.7,36.2 13.3,33.8 12.9,33.8 12.7,33.6 R28.4 12.76,32.96
  Bottom 0.254: K1.23 36.1,51.02 36.07,51.02 34.75,49.7 34.75,48.75 34.1,48.1 34.1,47.1 33.6,46.6 33.6,44.5 v34.1,44
G4  (via drill 0.4)
  Top 0.254: v43.9,48.4 43.6,48.1 41.4,48.1 40.7,47.4 37.8,47.4 35.1,44.7 32,44.7 31.4,44.1 21.4,44.1 15.2,37.9 15.2,36.4 13.23,34.43 R29.1
  Bottom 0.254: K1.32 46.47,53.37 45.2,52.1 45.2,49.7 v43.9,48.4
G5
  Top 0.254: K1.33 47.48,49.7 45.7,49.7 45.2,49.2 43.6,49.2 43,48.6 41.2,48.6 40.5,47.9 37.6,47.9 34.9,45.2 31.8,45.2 31.2,44.6 21.2,44.6 14.7,38.1 14.7,36.6 13.43,35.33 R29.2
G6  (via drill 0.4)
  Top 0.254: R29.3 13.53,36.13 14.2,36.8 14.2,38.3 20.3,44.4 v20.3,45.4 | K1.8 15.99,53.41 17.3,52.1 17.3,50.1 17.8,49.6 19.2,49.6 v19.7,50.1
  Bottom 0.254: v20.3,45.4 20.3,46.2 19.4,47.1 19.4,49.8 v19.7,50.1
G7  (via drill 0.4)
  Top 0.254: R29.4 12.93,37.03 13.7,37.8 13.7,38.5 19.2,44 v19.2,45.4
  Bottom 0.254: v19.2,45.4 19.2,46.6 18.9,46.9 18.9,48.2 17.3,49.8 17.3,52.54 K1.10
GND  (via drill 0.4)  (70 unrouted)
  Top 0.254: U1.13 50.93,9.6 50.73,9.79 50.73,9.71 U1.P$20 | U1.10 49.47,9.91 49.46,9.92 49.21,9.67 U1.P$21 48.82,9.74 48.82,10.18 48.75,10.25 U1.7 | U1.6 49.04,10.9 49.2,11.06 | U1.5 48.82,11.55 U1.P$22 | J1.29 2.5,41.76 v2.44,41.82 | J1.36 5.06,45.26 4.6,44.8 4.6,43.8 v4.57,43.72 | J1.3 4.59,28.76 v3.92,27.93
  Top 0.406: U1.P$22 48.89,11.38 49.2,11.06 | 49.47,9.91 49.47,10.25 U1.THERMAL | 50.73,9.79 50.57,9.79 U1.THERMAL | U1.P$19 U1.THERMAL | U1.P$20 51.33,9.67 51.4,9.6 52.2,9.6 U1.13 | 47.66,4.8 R2.1 v49.29,4.74 v49.3,4.75 49.25,4.75 49.47,4.97 U1.10 | v44,5.25 44,4.34 C1.2
  Bottom 0.406: v44,5.25 44,5.5 44,6.1 44,6.6 44.7,7.3 47.6,7.3 49.3,5.6 v49.3,4.75
  other vias: 30.2,14.8 30.2,13.6 31.4,13.6 31.4,14.8 7.2,4.5 8.1,4.5 7.1,1.2 8,1.2 16.5,1.4 16.5,3 16.5,4.7 16.5,6.2 16.5,7.8 20.2,12.4 20.2,11.4 19.3,11.4 19.3,12.4 23.7,12.5 22.6,16.3 22.6,18.9 56.6,6.7 56.6,9 55.9,5.4 53.8,5.4
GPIO22
  Bottom 0.254: R9.2 24.8,36 25.9,37.1 28.8,37.1 31.2,39.5 31.2,41.2 30.3,42.1 30.3,50.3 29.9,50.7 29.9,51.9 29.3,52.5 26.9,52.5 26.2,51.8 26.2,51.28 K1.15
GPIO23
  Bottom 0.254: R33.1 24.4,41.5 26.3,39.6 27.8,39.6 28.3,40.1 28.3,47 24.9,50.4 24.9,51.8 26.15,53.05 K1.16
GPIO24  (via drill 0.4)
  Top 0.254: v27.7,48.8 28.4,48.8 30,50.4 30,52.46 K1.18
  Bottom 0.254: R33.2 24.6,40.6 26.1,39.1 28,39.1 28.8,39.9 28.8,47.8 v27.7,48.8
GPIO25  (via drill 0.4)
  Top 0.254: v32.5,50.2 32.3,50.2 31.3,49.2 29.7,49.2 29.5,49 v29.5,48.9
  Bottom 0.254: K1.22 32.5,52.5 v32.5,50.2 | R9.1 25,36.9 25.7,37.6 28.6,37.6 30.7,39.7 30.7,41 29.8,41.9 29.8,48.6 v29.5,48.9
GPIO26  (via drill 0.4)
  Top 0.254: K1.37 54.09,50.29 51.6,47.8 49.2,47.8 48.6,47.2 46.7,47.2 45.1,45.6 42.4,45.6 41.7,44.9 38.8,44.9 34.5,40.6 29.7,40.6 v29.5,40.4
  Bottom 0.254: R33.3 24.7,39.8 25.9,38.6 28.2,38.6 29.5,39.9 v29.5,40.4
GPIO27  (via drill 0.4)  (1 unrouted)
  Top 0.254: K1.13 23.6,51.3 24.8,52.5 27.1,52.5 27.5,52.1 v27.5,50.3
  Bottom 0.254: R33.4 24.9,38.9 25.7,38.1 28.4,38.1 30.2,39.9 30.2,40.8 29.3,41.7 29.3,48 28.6,48.7 28.6,49.2 v27.5,50.3
HSYNC  (via drill 0.4)
  Top 0.254: R32.2 13.42,47.52 14,48.1 v14,48.7
  Bottom 0.254: K1.5 13.8,50.88 13.8,49.7 14,49.5 v14,48.7
LBO  (via drill 0.4)
  Top 0.406: U1.12 50.77,8.23 50.9,8.1 v51.4,8.1 | T1.B 42.03,7.47 v42.4,7.1
  Bottom 0.406: v51.4,8.1 49,8.1 48.1,9 47.2,9 47,9.2 46.3,9.2 45.1,8 44.2,8 43.3,7.1 v42.4,7.1
LEDK  (1 unrouted)
  Top 0.254: 6.25,27.75 J1.1 7.14,27.76 9.7,25.2 | 9.7,25.2 10.9,25.2 | 10.9,25.2 13.4,25.2 | 13.4,25.2 17.9,25.2 18.3,24.8 18.3,24.05 R21.2 18.45,24 20.79,24 D3.A | 9.7,25.2 9.05,25.2 R23.2 | R25.2 10.9,25.2 | R24.2 13.4,25.2
  Top 0.61: C18.1 U4.3 23.3,23.3 22.3,24.3
N$1
  pour Top (isolate 0.254, rank 2, no thermals): 49.5,12.2 40.7,12.2 40.7,14.8 41,15.1 49.3,15.1 49.5,14.9
N$2
  Top 0.254: R20.1 53.75,2.1 LOWPWR.A
N$3
  Top 0.406: U1.9 48.82,8.12 47.6,6.9 R2.2 47.6,6.37 47.6,6.3 46.03,4.73 R1.1
N$4
  pour Top (isolate 0.254, rank 2, no thermals): 17.8,11.8 14.4,11.8 10.7,8.1 10.7,1.1 11.5,0.3 15.5,0.3 15.6,0.4 15.6,7.4 15.2,7.8 15.2,10.6 17.8,10.6
N$5
  Top 0.406: 53.52,8.48 R4.2 53.41,8.56 53.41,10.2 | R3.1 53.41,10.2 | U1.14 53.36,10.25 53.41,10.2
N$6
  Top 0.254: T1.C 41.83,5.67 42.7,4.8 42.7,3.4 42.9,3.2 48.05,3.2 R20.2
N$7
  Top 0.254: LED2.A 57.9,2.15 R5.2
N$8
  Top 0.254: R6.1 R7.1 34.05,16.73 U2.P$2
N$9  (via drill 0.4)  (1 unrouted)
  Top 0.254: R14.1 34.3,8.6 v34.6,8.9 | v26.6,17 27.4,17 27.8,16.6 29.09,16.6 U2.P$7
N$10
  Top 0.254: U2.P$13 28.71,12.1 26.3,12.1 24.65,13.75 R16.2
N$11  (via drill 0.4)  (1 unrouted)
  Top 0.254: R8.1 36.45,7.55 35.7,8.3 35.7,8.8 v35.6,8.9 | v27.2,16.1 28.89,16.1 U2.P$8
N$12
  Bottom 0.254: R9.7 21.4,36 21,35.6 21,34.1 20.1,33.2 19.2,33.2 U3.SCLK
N$13
  Bottom 0.254: R9.8 21.6,36.9 20.2,35.5 19.5,35.5 U3.MOSI
N$14
  Bottom 0.254: R33.5 21.8,38.9 20,37.1 19.1,37.1 U3.GPIO10
N$15
  Bottom 0.254: R33.6 21.3,39.8 20.9,39.4 19.4,39.4 U3.GPIO9
N$16
  Bottom 0.254: U3.MISO 20.8,41 21.2,40.6 R33.7
N$17
  Bottom 0.254: U3.CS0 20.65,43 R33.8
N$18
  Top 0.61: D1.A 25.95,27.68 L2.P$2 27.31,29.04 U4.1
N$19
  Top 0.254: THERM.2 31.25,18.45 32,17.7 32,16.8 U2.P$5
N$20
  Top 0.254: DONE.C R14.2
N$21
  Top 0.254: CHRG/LBO.C R8.2
N$22
  Top 0.254: U2.P$12 28.5,12.6 26.5,12.6 25.8,13.3 25.8,17 25.2,17.6 R17.2
N$23
  Top 0.254: R23.1 8.25,22.65 7.6,22 5.6,22 4.8,21.2 2.68,21.2 SJ1.2
N$24
  Top 0.254: R24.1 13.4,22.4 12.5,21.5 10.6,21.5 10.1,21 7.98,21 SJ2.2
N$25
  Bottom 0.254: R19.2 21.4,43.6 20.9,44.1 16.7,44.1 16.3,44.5 3.2,44.5 3,44.7 3,46.4 U3.RESET
N$26
  Top 0.254: R25.1 10.9,22.5 9.9,21.5 5.78,21.5 SJ3.2
N$27
  Top 0.254: R28.7 10.59,31.26 8.67,33.19 8.48,33.26 J1.12 4.56,33.26 4.3,33 4.3,31.2 5.24,30.26 J1.6
N$28  (via drill 0.4)
  Top 0.254: R28.8 10.73,30.36 8.34,32.76 J1.11 5.36,32.76 v5,32.4 | J1.5 5.04,29.76 3.8,31 3.8,32.7 v3.5,33
  Bottom 0.254: v3.5,33 4.4,33 v5,32.4
N$29
  Top 0.254: J1.10 8.08,32.26 10.06,30.27 10.06,30.01 10.45,29.63 10.95,29.63 11.08,29.5 11.08,28.99 R27.1
N$30
  Top 0.254: J1.9 7.81,31.76 9.43,30.14 9.43,29.89 10.06,29.25 10.06,28.23 10.32,27.98 10.97,27.98 R27.2
N$31
  Top 0.254: J1.8 7.55,31.26 8.79,30.01 8.79,29.76 9.56,29 9.56,27.85 10.19,27.22 10.97,27.22 R27.3
N$32
  Top 0.254: J1.7 7.29,30.76 8.16,29.89 8.16,29.63 8.92,28.87 8.92,27.47 10.06,26.33 10.96,26.33 R27.4
N$33
  Top 0.254: J1.15 7.86,34.76 10.55,32.06 R28.6
N$34
  Top 0.254: J1.16 8.12,35.26 10.42,32.96 R28.5
N$35
  Top 0.254: J1.17 8.39,35.76 9.68,34.46 10.96,34.46 R29.8
N$36
  Top 0.254: J1.18 8.65,36.26 9.58,35.33 R29.7
N$37
  Top 0.254: R29.6 9.54,36.13 8.91,36.76 J1.19 4.11,36.76 3.84,36.49 3.84,33.95 4.04,33.76 J1.13
N$38  (via drill 0.4)
  Top 0.254: R29.5 9.4,37.03 9.17,37.26 J1.20 3.56,37.26 v3.5,37.2 | J1.14 5.14,34.26 v4.7,34.7
  Bottom 0.254: v4.7,34.7 4.7,36.86 4.3,37.26 3.56,37.26 v3.5,37.2
N$39
  Top 0.254: J1.23 8.18,38.76 8.44,38.49 R30.8
N$40
  Top 0.254: J1.24 8.13,39.26 8.29,39.41 10.97,39.41 R30.7
N$41
  Top 0.254: J1.25 7.87,39.76 8.29,40.17 10.97,40.17 R30.6
N$42
  Top 0.254: J1.26 7.61,40.26 8.41,41.06 10.96,41.06 R30.5
N$43
  Top 0.254: R31.8 10.96,42.59 9.18,42.59 7.35,40.76 J1.27 4.17,40.76 3.84,40.43 3.84,37.89 3.97,37.76 J1.21
N$44  (via drill 0.4)
  Top 0.254: R31.7 10.97,43.48 9.3,43.48 7.08,41.26 J1.28 3.86,41.26 3.3,40.7 3.3,38.7 v3,38.4 | 4.9,38.3 v4.7,38.5 4.94,38.26 J1.22
  Bottom 0.254: v3,38.4 4.6,38.4 v4.7,38.5
N$45
  Top 0.254: J1.30 7.32,42.26 9.3,44.24 9.3,46.14 9.81,46.65 10.96,46.65 R32.8
N$46
  Top 0.254: J1.32 7.56,43.26 8.67,44.36 8.67,46.52 9.68,47.54 10.97,47.54 R32.7
N$47
  Top 0.254: J1.33 7.3,43.76 8.03,44.49 8.03,47.28 9.05,48.3 10.97,48.3 R32.6
N$48
  Top 0.254: J1.34 7.04,44.26 7.53,44.74 7.53,47.67 9.05,49.19 10.96,49.19 R32.5
ON/OFF  (via drill 0.4)
  Top 0.254: J1.31 3.93,42.76 3.71,42.97 2.06,42.97 v1.31,42.21
  Bottom 0.254: R26.1 v1.31,42.21
PWM
  Top 0.61: U4.4 R22.1
R2  (via drill 0.4)
  Top 0.254: v50.9,48.5 50.7,48.3 49,48.3 48.4,47.7 46.5,47.7 44.9,46.1 42.2,46.1 41.5,45.4 38.6,45.4 34.3,41.1 28.9,41.1 27.5,39.7 25.9,39.7 25.5,40.1 23,40.1 19.2,36.3 19.2,34.8 16.8,32.4 16.8,31.1 14.8,29.1 14.8,28 13.1,26.3 R27.5
  Bottom 0.254: v50.9,48.5 50.9,49.9 50.3,50.5 50.3,52.52 K1.36
R3  (via drill 0.4)
  Top 0.254: R27.6 13.2,27.2 14.3,28.3 14.3,29.3 16.3,31.3 16.3,32.6 18.7,35 18.7,36.5 22.8,40.6 25.7,40.6 26.1,40.2 27.2,40.2 27.6,40.6 v27.6,40.9 | v24.7,49.6 24.5,49.8 21.4,49.8 21.1,50.1 21.1,51.2 K1.11
  Bottom 0.254: v27.6,40.9 27.6,41.6 27.8,41.8 27.8,46.8 25,49.6 v24.7,49.6
R4  (via drill 0.4)
  Top 0.254: R27.7 13.2,28 13.8,28.6 13.8,29.5 15.8,31.5 15.8,32.8 18.2,35.2 18.2,36.7 22.6,41.1 25.9,41.1 26.1,40.9 v26.5,40.9
  Bottom 0.254: K1.12 21.07,53.43 22.3,52.2 22.3,50.2 22.7,49.8 23.5,49.8 24.4,48.9 25,48.9 27.3,46.6 27.3,42 26.5,41.2 v26.5,40.9
R5  (via drill 0.4)
  Top 0.254: v51.6,49.2 51.4,49.4 50.7,49.4 50.1,48.8 48.8,48.8 48.2,48.2 46.3,48.2 44.7,46.6 42,46.6 41.3,45.9 38.4,45.9 34.1,41.6 22.4,41.6 17.7,36.9 17.7,35.4 15.3,33 15.3,31.7 12.69,29.09 R27.8
  Bottom 0.254: v51.6,49.2 51.6,51.18 K1.35
R6  (via drill 0.4)
  Top 0.254: R28.1 12.73,30.4 13.3,30.4 14.8,31.9 14.8,33.2 17.2,35.6 17.2,37.1 22.2,42.1 33.9,42.1 38.2,46.4 41.1,46.4 41.8,47.1 44.5,47.1 46.1,48.7 48,48.7 48.6,49.3 49.9,49.3 50.5,49.9 v52.3,49.9
  Bottom 0.254: v52.3,49.9 52.8,50.4 52.8,52.48 K1.38
R7
  Top 0.254: R28.2 12.73,31.3 13.5,31.3 14.3,32.1 14.3,33.4 16.7,35.8 16.7,37.3 22,42.6 33.7,42.6 38,46.9 40.9,46.9 41.6,47.6 44.3,47.6 45.9,49.2 47.8,49.2 48.4,49.8 49.6,49.8 50.3,50.5 50.3,51.8 51,52.5 55.4,52.5 56.63,53.73 K1.40
VBAT  (via drill 0.4)  (1 unrouted)
  Top 0.254: v51.8,4.7 51.8,5.9 52.6,6.7 53.35,6.7 C4.1
  Top 0.406: U1.8 | R13.1 50.75,4.8 50.8,4.7 v51.8,4.7
  Bottom 0.406: v46.7,8.2 47.8,8.2 51.3,4.7 v51.8,4.7
  pour Top (isolate 0.254, no thermals): 35.3,9.1 43.1,9.1 43.1,6.6 44,6.6 44.6,6 46.2,6 46.2,7.8 48.1,7.8 48.1,9.8 46.4,9.8 46.4,11.7 40.5,11.7 40.1,12.1 40.1,14.7 39.7,15.1 33,15.1 32.6,14.7 32.6,13.7 33.3,13 34.4,13 35.1,12.3 35.1,9.3
VBUS  (via drill 0.4)  (3 unrouted)
  Top 0.254: U2.P$3 U2.P$4 32.3,16.4 v32.7,16.4 32.5,16.6 32.5,19.1 31.9,19.7 31.9,20.5 31.6,20.8 C8.1 31.4,20.8 32.6,22 35.8,22 36,21.8 36,20.85 R6.2 | v27.7,15.2 28.1,15.6 28.68,15.6 U2.P$9
  Bottom 0.254: v33.7,12 33.7,15.4 v32.7,16.4 28.9,16.4 v27.7,15.2
  other vias: 33.2,11.4 32.6,10.8 22.7,3.5 22.7,2.6 22.7,1.7
  pour Top (no thermals): 21,4.1 21,7.7 20.5,8.2 20.5,10.3 20.4,10.4 15.8,10.4 15.6,10.2 15.6,9.5 15.7,9.4 18,9.4 18.2,9.2 18.2,8.3 18.1,8.2 17.7,8.2 17.4,7.9 17.4,0.4 27.1,0.4 27.1,4.1
  pour Bottom (isolate 0.254, no thermals): 34.4,11.7 33.5,12.6 31.8,10.9 23,10.9 22.1,10 22.1,1.2 23.3,1.2 23.3,9.2 23.8,9.7 32.4,9.7
  pour Top (isolate 0.254, rank 3, no thermals): 31.5,12.7 31.5,12.5 32.2,11.8 32.2,10.5 32.4,10.3 34.8,10.3 34.8,12.1 34.2,12.7 33.2,12.7 32.4,13.5 32.3,13.5
VLIPO  (2 unrouted)
  pour Top (isolate 0.254, rank 2, no thermals): 29.9,12.8 30.4,12.3 31.4,12.3 32,11.7 32,9.3 29.4,9.3 29.4,12.3
VSYNC
  Top 0.254: R32.3 12.18,48.32 11.9,48.6 11.9,50.24 K1.3

### Text on the board
bPlace: 20k
tStop: BATTLOW | PWRON | FULL | CHARGE
routoute: 33R | 33R | 3.3V AUX | 33R | 33R | DPI DISPLAY | 40PINFPCM4-1734839-0 | 33R | 1U | 1U | 33R | 12R | 6R | 12R | 12R | BACKLIGHT | B/L | +50mA | +25mA | +25mA | STEPUP | STEPDOWN | LITHIUM CHARGER